# Altium schematic sheet Channel_supply.SchDoc
size A2
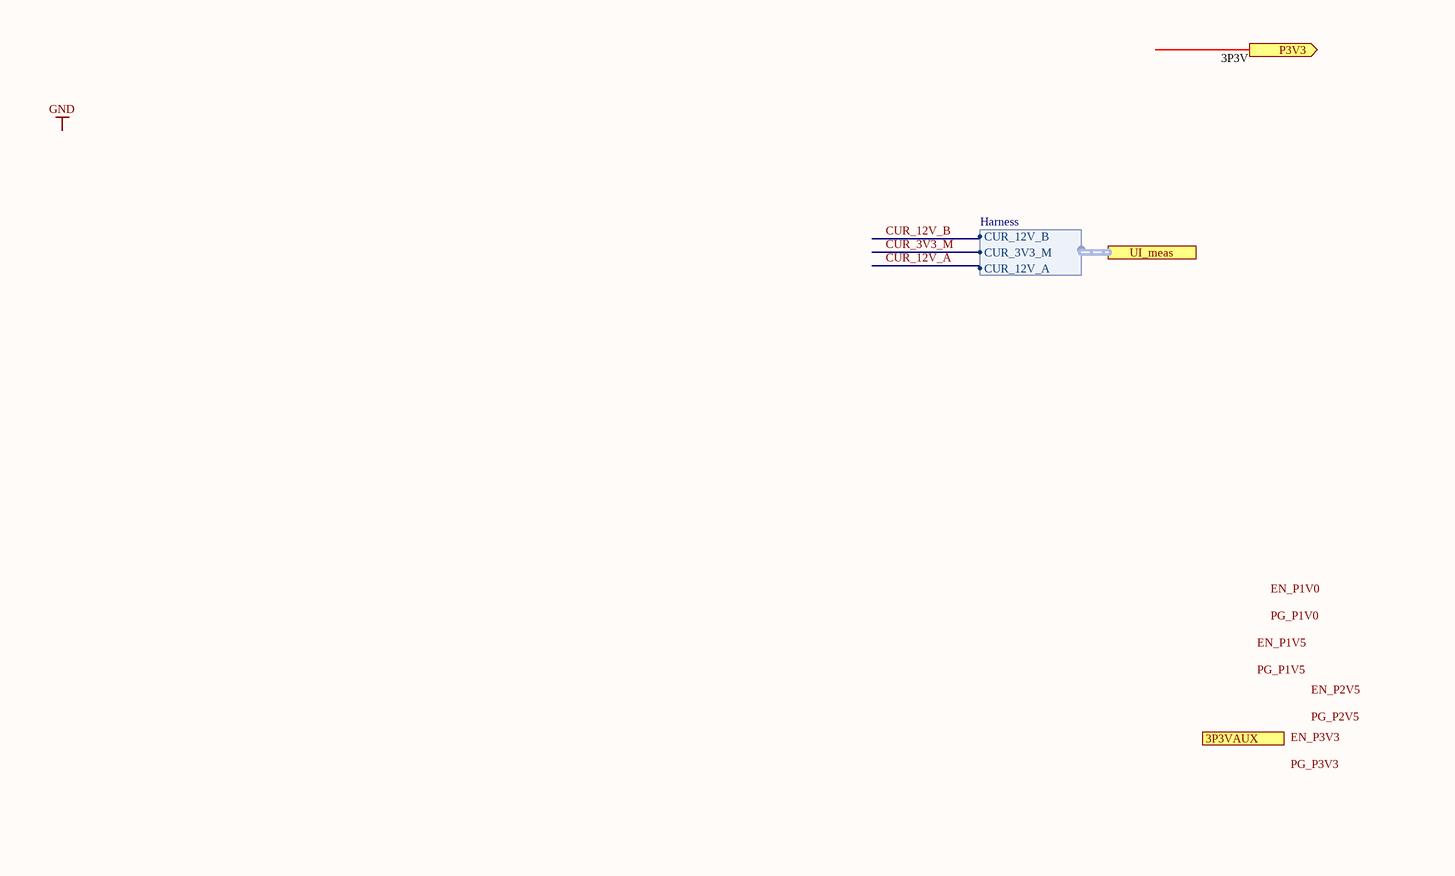
[diagram p0: Channel_supply.SchDoc, left]
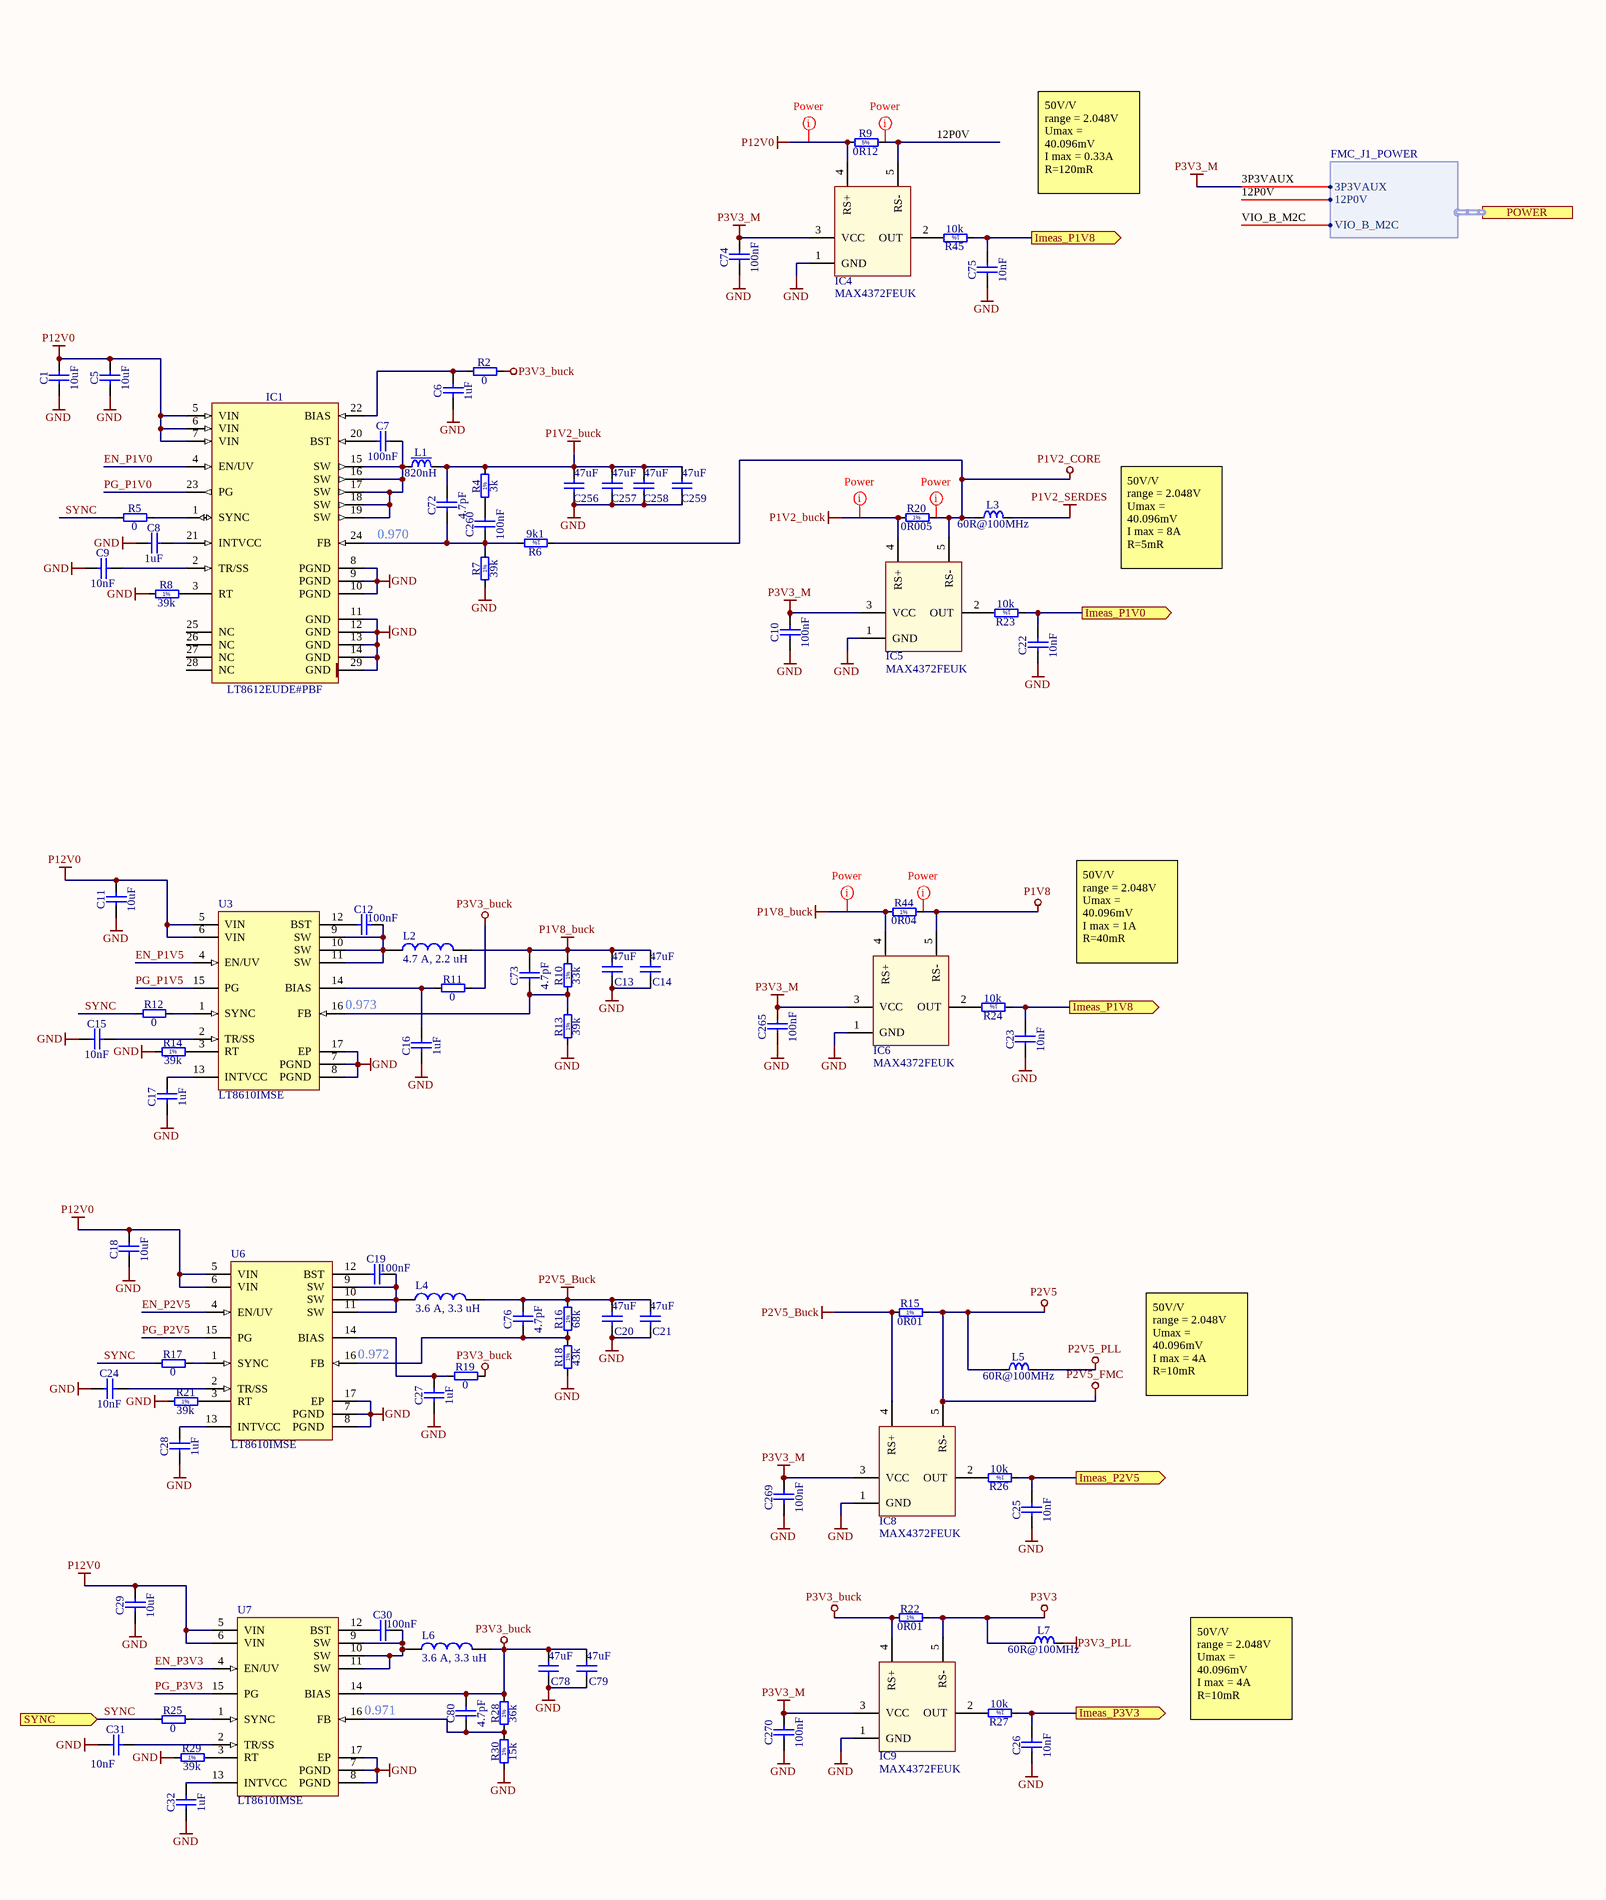
[diagram p1: Channel_supply.SchDoc, right]

## Parts
C1  10uF  [CAPC2012X95N]
C5  10uF  [CAPC2012X95N]
C6  1uF  [CAPC1608X87N]
C7  100nF  [CAPC1005X55N]
C8  1uF  [CAPC1608X87N]
C9  10nF  [CAPC1005X55N]
C10  100nF  [CAPC1005X55N]
C11  10uF  [CAPC2012X95N]
C12  100nF  [CAPC1005X55N]
C13  47uF  [CAPC2012X140N]
C14  47uF  [CAPC2012X140N]
C15  10nF  [CAPC1005X55N]
C16  1uF  [CAPC1608X87N]
C17  1uF  [CAPC1608X87N]
C18  10uF  [CAPC2012X95N]
C19  100nF  [CAPC1005X55N]
C20  47uF  [CAPC2012X140N]
C21  47uF  [CAPC2012X140N]
C22  10nF  [CAPC1005X55N]
C23  10nF  [CAPC1005X55N]
C24  10nF  [CAPC1005X55N]
C25  10nF  [CAPC1005X55N]
C26  10nF  [CAPC1005X55N]
C27  1uF  [CAPC1608X87N]
C28  1uF  [CAPC1608X87N]
C29  10uF  [CAPC2012X95N]
C30  100nF  [CAPC1005X55N]
C31  10nF  [CAPC1005X55N]
C32  1uF  [CAPC1608X87N]
C72  4.7pF  [CAPC1005X55N]
C73  4.7pF  [CAPC1005X55N]
C74  100nF  [CAPC1005X55N]
C75  10nF  [CAPC1005X55N]
C76  4.7pF  [CAPC1005X55N]
C78  47uF  [CAPC2012X140N]
C79  47uF  [CAPC2012X140N]
C80  4.7pF  [CAPC1005X55N]
C256  47uF  [CAPC2012X140N]
C257  47uF  [CAPC2012X140N]
C258  47uF  [CAPC2012X140N]
C259  47uF  [CAPC2012X140N]
C260  100nF  [CAPC1005X55N]
C265  100nF  [CAPC1005X55N]
C269  100nF  [CAPC1005X55N]
C270  100nF  [CAPC1005X55N]
IC1  LT8612EUDE#PBF  [QFN50P300X600X80-29N-R180X485]
IC4  MAX4372FEUK  [SOT95P270X145-5N]
IC5  MAX4372FEUK  [SOT95P270X145-5N]
IC6  MAX4372FEUK  [SOT95P270X145-5N]
IC8  MAX4372FEUK  [SOT95P270X145-5N]
IC9  MAX4372FEUK  [SOT95P270X145-5N]
L1  820nH  [INDP4040X21N]
L2  4.7 A, 2.2 uH  [WE-MAIA_4020]
L3  60R@100MHz  [INDC4516X180N]
L4  3.6 A, 3.3 uH  [WE-MAIA_4020]
L5  60R@100MHz  [INDC4516X180N]
L6  3.6 A, 3.3 uH  [WE-MAIA_4020]
L7  60R@100MHz  [INDC4516X180N]
R2  0  [RESC1005X40N]
R4  3k  [RESC1005X40N]
R5  0  [RESC1005X40N]
R6  9k1  [RESC1005X40N]
R7  39k  [RESC1005X40N]
R8  39k  [RESC1005X40N]
R9  0R12  [RESC2012X70N]
R10  33k  [RESC1005X40N]
R11  0  [RESC1005X40N]
R12  0  [RESC1005X40N]
R13  39k  [RESC1005X40N]
R14  39k  [RESC1005X40N]
R15  0R01  [RESC3216X80N]
R16  68k  [RESC1005X40N]
R17  0  [RESC1005X40N]
R18  43k  [RESC1005X40N]
R19  0  [RESC1005X40N]
R20  0R005  [RESC3216X80N]
R21  39k  [RESC1005X40N]
R22  0R01  [RESC3216X80N]
R23  10k  [RESC1005X40N]
R24  10k  [RESC1005X40N]
R25  0  [RESC1005X40N]
R26  10k  [RESC1005X40N]
R27  10k  [RESC1005X40N]
R28  36k  [RESC1005X40N]
R29  39k  [RESC1005X40N]
R30  15k  [RESC1005X40N]
R44  0R04  [RESC3216X89N]
R45  10k  [RESC1005X40N]
U3  LT8610IMSE  [LT-MSE-16-EDP_L]
U6  LT8610IMSE  [LT-MSE-16-EDP_L]
U7  LT8610IMSE  [LT-MSE-16-EDP_L]

## Ports
3P3VAUX (out), Imeas_P1V0 (out), Imeas_P1V8 (out), Imeas_P2V5 (out), Imeas_P3V3 (out), P3V3 (out), POWER (harness FMC_J1_POWER), SYNC (in), UI_meas (harness Harness)

## Harnesses
FMC_J1_POWER: 3P3VAUX, 12P0V, VIO_B_M2C
Harness: CUR_12V_B, CUR_3V3_M, CUR_12V_A

## Nets
3P3VAUX: C10.2 C74.2 C265.2 C269.2 C270.2 IC4.3(VCC) IC5.3(VCC) IC6.3(VCC) IC8.3(VCC) IC9.3(VCC) ; port POWER.3P3VAUX  [also labelled P3V3_M]
GND: C1.1 C5.1 C6.1 C8.1 C9.1 C10.1 C11.1 C13.1 C14.1 C15.1 C16.1 C17.1 C18.1 C20.1 C21.1 C22.1 C23.1 C24.1 C25.1 C26.1 C27.1 C28.1 C29.1 C31.1 C32.1 C74.1 C75.1 C78.1 C79.1 C256.1 C257.1 C258.1 C259.1 C265.1 C269.1 C270.1 IC1.8(PGND) IC1.9(PGND) IC1.10(PGND) IC1.11(GND) IC1.12(GND) IC1.13(GND) IC1.14(GND) IC1.29(GND) IC4.1(GND) IC5.1(GND) IC6.1(GND) IC8.1(GND) IC9.1(GND) R7.1 R8.1 R13.1 R14.1 R18.1 R21.1 R29.1 R30.1 U3.7(PGND) U3.8(PGND) U3.17(EP) U6.7(PGND) U6.8(PGND) U6.17(EP) U7.7(PGND) U7.8(PGND) U7.17(EP)
P1V2_buck: C72.2 C256.2 C257.2 C258.2 C259.2 IC5.4(RS+) L1.2 R4.2 R20.1
P1V2_CORE: IC5.5(RS-) L3.1 R6.1 R20.2
P1V2_SERDES: L3.2
P1V8: IC6.5(RS-) R44.2
P1V8_buck: C13.2 C14.2 C73.2 IC6.4(RS+) L2.2 R10.2 R44.1
P2V5: IC8.5(RS-) L5.1 R15.2  [also labelled P2V5_FMC]
P2V5_Buck: C20.2 C21.2 C76.2 IC8.4(RS+) L4.2 R15.1 R16.2
P2V5_PLL: L5.2
P3V3: IC9.5(RS-) L7.1 R22.2
P3V3_buck: C78.2 C79.2 C80.2 IC9.4(RS+) L6.2 R2.2 R11.2 R19.2 R22.1 R28.2 U7.14(BIAS)
P3V3_PLL: L7.2
P12V0: C1.2 C5.2 C11.2 C18.2 C29.2 IC1.5(VIN) IC1.6(VIN) IC1.7(VIN) IC4.4(RS+) R9.1 U3.5(VIN) U3.6(VIN) U6.5(VIN) U6.6(VIN) U7.5(VIN) U7.6(VIN)
3P3V: port P3V3
12P0V: IC4.5(RS-) R9.2 ; port POWER.12P0V
CUR_3V3_M: harness Harness.CUR_3V3_M
EN_P1V0: IC1.4(EN/UV)
EN_P1V5: U3.4(EN/UV)
EN_P2V5: U6.4(EN/UV)
EN_P3V3: U7.4(EN/UV)
Imeas_P1V0: C22.2 R23.1 ; port Imeas_P1V0
Imeas_P1V8: C23.2 C75.2 R24.1 R45.1 ; port Imeas_P1V8
Imeas_P2V5: C25.2 R26.1 ; port Imeas_P2V5
Imeas_P3V3: C26.2 R27.1 ; port Imeas_P3V3
PG_P1V0: IC1.23(PG)
PG_P1V5: U3.15(PG)
PG_P2V5: U6.15(PG)
PG_P3V3: U7.15(PG)
SYNC: R5.1 R12.1 R17.1 R25.1 ; port SYNC
VIO_B_M2C: port POWER.VIO_B_M2C
NetC6_2: C6.2 IC1.22(BIAS) R2.1
NetC7_1: C7.1 IC1.20(BST)
NetC7_2: C7.2 IC1.15(SW) IC1.16(SW) IC1.17(SW) IC1.18(SW) IC1.19(SW) L1.1
NetC8_2: C8.2 IC1.21(INTVCC)
NetC9_2: C9.2 IC1.2(TR/SS)
NetC12_1: C12.1 U3.12(BST)
NetC12_2: C12.2 L2.1 U3.9(SW) U3.10(SW) U3.11(SW)
NetC15_2: C15.2 U3.2(TR/SS)
NetC16_2: C16.2 R11.1 U3.14(BIAS)
NetC17_2: C17.2 U3.13(INTVCC)
NetC19_1: C19.1 U6.12(BST)
NetC19_2: C19.2 L4.1 U6.9(SW) U6.10(SW) U6.11(SW)
NetC24_2: C24.2 U6.2(TR/SS)
NetC27_2: C27.2 R19.1 U6.14(BIAS)
NetC28_2: C28.2 U6.13(INTVCC)
NetC30_1: C30.1 U7.12(BST)
NetC30_2: C30.2 L6.1 U7.9(SW) U7.10(SW) U7.11(SW)
NetC31_2: C31.2 U7.2(TR/SS)
NetC32_2: C32.2 U7.13(INTVCC)
NetC72_1: C72.1 C260.1 IC1.24(FB) R6.2 R7.2
NetC73_1: C73.1 R10.1 R13.2 U3.16(FB)
NetC76_1: C76.1 R16.1 R18.2 U6.16(FB)
NetC80_1: C80.1 R28.1 R30.2 U7.16(FB)
NetC260_2: C260.2 R4.1
NetIC1_1: IC1.1(SYNC) R5.2
NetIC1_3: IC1.3(RT) R8.2
NetIC4_2: IC4.2(OUT) R45.2
NetIC5_2: IC5.2(OUT) R23.2
NetIC6_2: IC6.2(OUT) R24.2
NetIC8_2: IC8.2(OUT) R26.2
NetIC9_2: IC9.2(OUT) R27.2
NetR12_2: R12.2 U3.1(SYNC)
NetR14_2: R14.2 U3.3(RT)
NetR17_2: R17.2 U6.1(SYNC)
NetR21_2: R21.2 U6.3(RT)
NetR25_2: R25.2 U7.1(SYNC)
NetR29_2: R29.2 U7.3(RT)

Not connected (* = marked no-connect by the designer): IC1 25(NC) 26(NC) 27(NC) 28(NC)

## Layout directives
net class Power: 12P0V, P1V2_buck, P1V2_CORE, P1V8, P1V8_buck, P12V0

## Notes on the sheet
- 50V/V
  range = 2.048V
  Umax = 40.096mV
  I max = 0.33A
  R=120mR
- 0.970
- 50V/V
  range = 2.048V
  Umax = 40.096mV
  I max = 8A
  R=5mR
- 50V/V
  range = 2.048V
  Umax = 40.096mV
  I max = 1A
  R=40mR
- (near U3) 0.973
- (near U6) 0.972
- 50V/V
  range = 2.048V
  Umax = 40.096mV
  I max = 4A
  R=10mR
- (near U7) 0.971
- Labels drawn without touching a wire or pin: EN_P1V0, EN_P1V5, EN_P2V5, EN_P3V3, GND, PG_P1V0, PG_P1V5, PG_P2V5, PG_P3V3
- (in symbol R0402_3K_1%_0.0625W_100PPM) 1%
- (in symbol R0402_9K1_1%_0.0625W_100PPM) 1%
- (in symbol R0402_10K_1%_0.0625W_100PPM) 1%
- (in symbol R0402_15K_1%_0.0625W_100PPM) 1%
- (in symbol R0402_33K_1%_0.0625W_100PPM) 1%
- (in symbol R0402_36K_1%_0.0625W_100PPM) 1%
- (in symbol R0402_39K_1%_0.0625W_100PPM) 1%
- (in symbol R0402_43K_1%_0.0625W_100PPM) 1%
- (in symbol R0402_68K_1%_0.0625W_100PPM) 1%
- (in symbol R0805_0R12_5%_0.25W_250PPM_PANASONIC_ERJ) 5%
- (in symbol R1206_0R01_1%_1W_100PPM_TT_LRMAM1206) 1%
- (in symbol R1206_0R04_1%_0.5W_100PPM_VISHAY_WSL) 1%
- (in symbol R1206_0R005_1%_1W_100PPM_TT_LRMAM1206) 1%

## Library data of the parts
C1 C5 C11 C18 C29 = CC0805_10UF_25V_10%_X5R: Non-polarised capacitor; Part Description: SMD Multilayer Chip Ceramic Capacitor; Manufacturer: GENERIC; Manufacturer1 Part Number: GRM219R61E106KA12D; Voltage: 25V; TC: X5R; Tolerance: ±10%; Part Number: CC0805_10UF_25V_10%_X5R; Component Kind: Standard; Component Type: Standard; Pin Count: 2; Value: 10uF; Status: Preferred; Manufacturer Part Number: CC0805_10UF_25V_10%_X5R; Case: 0805; Mounted: Yes; Socket: No; SMD: Yes; Sense: No; Manufacturer1 Example: MURATA; Manufacturer1 ComponentHeight: 0.95mm; HelpURL: \\cern.ch\dfs\Applications\Altium\Datasheets\CC0805_X5R_MURATA_GRM.pdf; Author: CERN DEM JLC; CreateDate: 25/10/2012; LatestRevisionDate: 06/09/2016
C6 C8 C16 C17 C27 C28 C32 = CC0603_1UF_25V_10%_X7R: Non-polarised capacitor; Part Description: SMD Multilayer Chip Ceramic Capacitor; Manufacturer: GENERIC; Manufacturer1 Part Number: GRM188R71E105KA12D; Voltage: 25V; TC: X7R; Tolerance: ±10%; Part Number: CC0603_1UF_25V_10%_X7R; Component Kind: Standard; Component Type: Standard; Pin Count: 2; Value: 1uF; Status: None; Manufacturer Part Number: CC0603_1UF_25V_10%_X7R; Case: 0603; Mounted: Yes; Socket: No; SMD: Yes; Sense: No; Manufacturer1 Example: MURATA; Manufacturer1 ComponentHeight: 0.9mm; HelpURL: \\cern.ch\dfs\Applications\Altium\Datasheets\CC0603_X7R_MURATA.pdf; Author: CERN DEM JLC; CreateDate: 18/01/2011; LatestRevisionDate: 18/01/2011
C7 C10 C12 C19 C30 C74 C260 C265 C269 C270 = CC0402_100NF_25V_10%_X7R_YUDEN_TMK105B7104KVHF: Non-polarised capacitor; Part Description: SMD Multilayer Chip Ceramic Capacitor (High Dielectric Type) for Automotive / Industrial Applications; Manufacturer: TAIYO YUDEN; Voltage: 25V; TC: X7R; Tolerance: ±10%; Part Number: CC0402_100NF_25V_10%_X7R_YUDEN_TMK105B7104KVHF; Component Kind: Standard; Component Type: Standard; Pin Count: 2; Value: 100nF; Status: Not Recommended; Manufacturer Part Number: TMK105B7104KVHF; Case: 0402; Mounted: Yes; Socket: No; SMD: Yes; Sense: No; ComponentHeight: 0.55mm; HelpURL: \\cern.ch\dfs\Applications\Altium\Datasheets\CC0402_TAIYO-YUDEN_TMK105B7104KVHF.pdf; Author: CERN DEM JLC; CreateDate: 10/05/2017; LatestRevisionDate: 10/05/2017
C9 C15 C24 C31 = CC0402_10NF_25V_10%_X7R: Non-polarised capacitor; Part Description: SMD Multilayer Chip Ceramic Capacitor; Manufacturer: GENERIC; Manufacturer1 Part Number: C1005X7R1E103KT; Voltage: 25V; TC: X7R; Tolerance: ±10%; Part Number: CC0402_10NF_25V_10%_X7R; Component Kind: Standard; Component Type: Standard; Pin Count: 2; Value: 10nF; Status: Preferred; Manufacturer Part Number: CC0402_10NF_25V_10%_X7R; Case: 0402; Mounted: Yes; Socket: No; SMD: Yes; Sense: No; Manufacturer1 Example: TDK; Manufacturer1 ComponentHeight: 0.55mm; HelpURL: \\cern.ch\dfs\Applications\Altium\Datasheets\CC0402_X7R_TDK_C.pdf; Author: CERN DEM JLC; CreateDate: 25/10/2012; LatestRevisionDate: 25/10/2012
C13 C14 C20 C21 C78 C79 C256-C259 = CC0805_47UF_6.3V_20%_X5R: Non-polarised capacitor; Manufacturer: GENERIC; Part Description: SMD Multilayer Chip Ceramic Capacitor; Manufacturer1 Part Number: C0805C476M9PACTU; Voltage: 6.3V; TC: X5R; Tolerance: ±20%; Part Number: CC0805_47UF_6.3V_20%_X5R; Component Kind: Standard; Component Type: Standard; Pin Count: 2; Value: 47uF; Status: Preferred; Manufacturer Part Number: CC0805_47UF_6.3V_20%_X5R; Case: 0805; Mounted: Yes; Socket: No; SMD: Yes; Sense: No; Manufacturer1 Example: KEMET; Manufacturer1 ComponentHeight: 1.4mm; HelpURL: \\cern.ch\dfs\Applications\Altium\Datasheets\CC0805_X5R_KEMET.pdf; Author: CERN DEM JLC; CreateDate: 16/10/2012; LatestRevisionDate: 16/10/2012
C22 C23 C25 C26 C75 = CC0402_10NF_50V_10%_X7R: Non-polarised capacitor; Part Description: SMD Multilayer Chip Ceramic Capacitor; Manufacturer: GENERIC; Manufacturer1 Part Number: GRM155R71H103KA88D; Voltage: 50V; TC: X7R; Tolerance: ±10%; Part Number: CC0402_10NF_50V_10%_X7R; Component Kind: Standard; Component Type: Standard; Pin Count: 2; Value: 10nF; Status: None; Manufacturer Part Number: CC0402_10NF_50V_10%_X7R; Case: 0402; Mounted: Yes; Socket: No; SMD: Yes; Sense: No; Manufacturer1 Example: MURATA; Manufacturer1 ComponentHeight: 0.55mm; HelpURL: \\cern.ch\dfs\Applications\Altium\Datasheets\CC0402_X7R_MURATA_GRM.pdf; Author: CERN DEM MR; CreateDate: 08/01/2016; LatestRevisionDate: 08/01/2016
C72 C73 C76 C80 = CC0402_4.7PF_50V_0.25PF_C0G: Non-polarised capacitor; Part Description: SMD Multilayer Chip Ceramic Capacitor; Manufacturer: GENERIC; Manufacturer1 Part Number: C0402C479C5GACTU; Voltage: 50V; TC: C0G/NP0; Tolerance: ±0.25pF; Part Number: CC0402_4.7PF_50V_0.25PF_C0G; Component Kind: Standard; Component Type: Standard; Pin Count: 2; Value: 4.7pF; Status: Preferred; Manufacturer Part Number: CC0402_4.7PF_50V_0.25PF_C0G; Case: 0402; Mounted: Yes; Socket: No; SMD: Yes; Sense: No; Manufacturer1 Example: KEMET; Manufacturer1 ComponentHeight: 0.55mm; HelpURL: \\cern.ch\dfs\Applications\Altium\Datasheets\CC0805_C0G_KEMET_(Commercial Grade).pdf; Author: CERN DEM JLC; CreateDate: 03/12/2007; LatestRevisionDate: 22/04/2015
IC1 = LT8612EUDE#PBF: 42V, 6A Synchronous Step-Down Regulator with 3µA Quiescent Current; Part Description: 42V, 6A Synchronous Step-Down Regulator with 3uA Quiescent Current; Manufacturer: LINEAR TECHNOLOGY; PressFit: No; Bonding: No; Part Number: LT8612EUDE#PBF; Component Kind: Standard; Component Type: Standard; Device: LT8612EUDE#PBF; PackageDescription: QFN, 0.50mm Pitch, Rect.; 28 pin, 6.00mm L X 3.00mm W X 0.80mm H bodY (w/thermal tab 1.80 X 4.85mm), IPC Medium Density; Manufacturer Part Number: LT8612EUDE#PBF; Pin Count: 29; Case: QFN28; Mounted: Yes; Socket: No; SMD: Yes; Sense: No; ComponentHeight: 0.8mm; HelpURL: \\cern.ch\dfs\Applications\Altium\Datasheets\LT8612EUDE#PBF.pdf; Author: CERN DEM JLC; CreateDate: 16/05/2018; LatestRevisionDate: 16/05/2018
IC4-IC6 IC8 IC9 = PM_MAX4372FEUK: Manufacturer: Maxim; Part Description: High side current sense amplifier (x50); Bonding: No; PressFit: No; Case: SOT23-5; Component Kind: Standard; Component Type: Standard; ComponentHeigth: *; CreateDate: 2018-01-01; Device: MAX4372FEUK; Footprint: SOT23-5; HelpURL: *; LatestRevisionDate: 2018-01-01; Manufacturer Part Number: MAX4372FEUK; Mounted: Yes; PackageDescription: SOT23-5; Part Number: MAX4372FEUK; Pin Count: 5; Sense: No; SMD: Yes; Socket: No; Value: MAX4372FEUK
L1 = L_POWER_XEL4020_820uH_10A: Inductor With Core; Part Number: IND_820NH_COILCRAFT_XEL4020-821MEC; Part Description: SMT Power Inductor XEL4020 Series; Manufacturer: COILCRAFT; Manufacturer Part Number: XEL4020-821MEC; Power: 10A; Resistance: 0.011R; Tolerance: ±20%; Component Kind: Standard; Component Type: Standard; Pin Count: 2; Value: 820nH; Status: None; Case: 4040; Mounted: Yes; Socket: No; SMD: Yes; Sense: No; ComponentHeight: 2.03mm; HelpURL: \\cern.ch\dfs\Applications\Altium\Datasheets\IND_COILCRAFT_1008CS.pdf; Author: GK; CreateDate: 09/11/2017; LatestRevisionDate: 09/11/2017
L2 = 78438356022: WE-MAIA SMD Power Inductor, size 4020, 4.7 A, 2.2 uH; Rated Current: 4.7 A; Inductance: 2.2 uH; DC Resistance max.: 35 mOhm; ComponentLink1Description: Manufacturer; ComponentLink1URL: http://www.we-online.de; ComponentLink2Description: Datasheet; ComponentLink2URL: http://katalog.we-online.de/pbs/datasheet/78438356022.pdf; Part Number: 78438356022; Published Date: Nov. 2017; Publisher: Wurth Elektronik; Size: 4020; Operating Temperature: -40 to 125 degC
L3 L5 L7 = IND1806_MURATA_BLM41PG600SN1L: Inductor; Part Description: SMD EMI Suppression Chip Ferrite Bead (BLM41P Series); Manufacturer: MURATA; Power: 6A; Resistance: 0.01R; Part Number: IND1806_MURATA_BLM41PG600SN1L; Component Kind: Standard; Component Type: Standard; Pin Count: 2; Value: 60R@100MHz; Status: None; Manufacturer Part Number: BLM41PG600SN1L; Case: 1806; Mounted: Yes; Socket: No; SMD: Yes; Sense: No; ComponentHeight: 1.8mm; HelpURL: \\cern.ch\dfs\Applications\Altium\Datasheets\IND1806_MURATA_BLM41P.pdf; Author: CERN DEM JLC; CreateDate: 02/12/2009; LatestRevisionDate: 02/12/2009
L4 L6 = 78438356033: WE-MAIA SMD Power Inductor, size 4020, 3.6 A, 3.3 uH; Rated Current: 3.6 A; Inductance: 3.3 uH; DC Resistance max.: 48 mOhm; ComponentLink1Description: Manufacturer; ComponentLink1URL: http://www.we-online.de; ComponentLink2Description: Datasheet; ComponentLink2URL: http://katalog.we-online.de/pbs/datasheet/78438356033.pdf; Part Number: 78438356033; Published Date: Nov. 2017; Publisher: Wurth Elektronik; Size: 4020; Operating Temperature: -40 to 125 degC
R2 R5 R11 R12 R17 R19 R25 = R0402_0R_JUMPER: Resistor; Part Description: 1A (0.05R Max DC Resistance) Zero Ohm Jumper; Manufacturer: GENERIC; Manufacturer1 Part Number: 232270591001L; PressFit: No; Part Number: R0402_0R_JUMPER; Component Kind: Standard; Component Type: Standard; Pin Count: 2; Value: 0; Status: Not Recommended; Manufacturer Part Number: R0402_0R_JUMPER; Case: 0402; Mounted: Yes; Sense: No; Socket: No; SMD: Yes; Manufacturer1 Example: YAGEO PHYCOMP; Manufacturer1 ComponentHeight: 0.4mm; HelpURL: \\cern.ch\dfs\Applications\Altium\Datasheets\R0402_Phycomp_RC0402.pdf; Author: CERN DEM JLC; CreateDate: 03/12/2007; LatestRevisionDate: 17/10/2012
R4 = R0402_3K_1%_0.0625W_100PPM: Resistor - 1%; Part Description: General Purpose Thick Film Chip Resistor; Manufacturer: GENERIC; Manufacturer1 Part Number: 232270673002L; TC: ±100ppm/°C; PressFit: No; Part Number: R0402_3K_1%_0.0625W_100PPM; Component Kind: Standard; Component Type: Standard; Pin Count: 2; Value: 3k; Status: Not Recommended; Power: 0.0625W; Tolerance: ±1%; Manufacturer Part Number: R0402_3K_1%_0.0625W_100PPM; Case: 0402; Mounted: Yes; Sense: No; Socket: No; SMD: Yes; Manufacturer1 Example: YAGEO PHYCOMP; Manufacturer1 ComponentHeight: 0.4mm; HelpURL: \\cern.ch\dfs\Applications\Altium\Datasheets\R0402_Phycomp_RC0402.pdf; Author: CERN DEM JLC; CreateDate: 03/12/2007; LatestRevisionDate: 17/10/2012
R6 = R0402_9K1_1%_0.0625W_100PPM: Resistor - 1%; Part Description: General Purpose Thick Film Chip Resistor; Manufacturer: GENERIC; Manufacturer1 Part Number: 232270679102L; TC: ±100ppm/°C; PressFit: No; Part Number: R0402_9K1_1%_0.0625W_100PPM; Component Kind: Standard; Component Type: Standard; Pin Count: 2; Value: 9k1; Status: Not Recommended; Power: 0.0625W; Tolerance: ±1%; Manufacturer Part Number: R0402_9K1_1%_0.0625W_100PPM; Case: 0402; Mounted: Yes; Sense: No; Socket: No; SMD: Yes; Manufacturer1 Example: YAGEO PHYCOMP; Manufacturer1 ComponentHeight: 0.4mm; HelpURL: \\cern.ch\dfs\Applications\Altium\Datasheets\R0402_Phycomp_RC0402.pdf; Author: CERN DEM JLC; CreateDate: 03/12/2007; LatestRevisionDate: 17/10/2012
R7 R8 R13 R14 R21 R29 = R0402_39K_1%_0.0625W_100PPM: Resistor - 1%; Part Description: General Purpose Thick Film Chip Resistor; Manufacturer: GENERIC; Manufacturer1 Part Number: 232270673903; TC: ±100ppm/°C; PressFit: No; Part Number: R0402_39K_1%_0.0625W_100PPM; Component Kind: Standard; Component Type: Standard; Pin Count: 2; Value: 39k; Status: Not Recommended; Power: 0.0625W; Tolerance: ±1%; Manufacturer Part Number: R0402_39K_1%_0.0625W_100PPM; Case: 0402; Mounted: Yes; Sense: No; Socket: No; SMD: Yes; Manufacturer1 Example: YAGEO PHYCOMP; Manufacturer1 ComponentHeight: 0.4mm; HelpURL: \\cern.ch\dfs\Applications\Altium\Datasheets\R0402_Phycomp_RC0402.pdf; Author: CERN DEM JLC; CreateDate: 03/12/2007; LatestRevisionDate: 17/10/2012
R9 = R0805_0R12_5%_0.25W_250PPM_PANASONIC_ERJ: Resistor - 5%; Part Description: Low Resistance Thick Film Chip Resistor; Manufacturer Part Number: ERJ6BSJR12V; Power: 0.25W; TC: ±250ppm/°C; PressFit: No; Part Number: R0805_0R12_5%_0.25W_250PPM_PANASONIC_ERJ; Component Kind: Standard; Component Type: Standard; Pin Count: 2; Value: 0R12; Status: Not Recommended; Tolerance: ±5%; Manufacturer: PANASONIC; Case: 0805; Mounted: Yes; Sense: No; Socket: No; SMD: Yes; ComponentHeight: 0.7mm; HelpURL: \\cern.ch\dfs\Applications\Altium\Datasheets\R0805_PANASONIC_ERJ.pdf; Author: CERN DEM JLC; CreateDate: 19/12/2011; LatestRevisionDate: 19/12/2011
R10 = R0402_33K_1%_0.0625W_100PPM: Resistor - 1%; Part Description: General Purpose Thick Film Chip Resistor; Manufacturer: GENERIC; Manufacturer1 Part Number: 232270673303L; TC: ±100ppm/°C; PressFit: No; Part Number: R0402_33K_1%_0.0625W_100PPM; Component Kind: Standard; Component Type: Standard; Pin Count: 2; Value: 33k; Status: Not Recommended; Power: 0.0625W; Tolerance: ±1%; Manufacturer Part Number: R0402_33K_1%_0.0625W_100PPM; Case: 0402; Mounted: Yes; Sense: No; Socket: No; SMD: Yes; Manufacturer1 Example: YAGEO PHYCOMP; Manufacturer1 ComponentHeight: 0.4mm; HelpURL: \\cern.ch\dfs\Applications\Altium\Datasheets\R0402_Phycomp_RC0402.pdf; Author: CERN DEM JLC; CreateDate: 03/12/2007; LatestRevisionDate: 17/10/2012
R15 R22 = R1206_0R01_1%_1W_100PPM_TT_LRMAM1206: Resistor - 1%; Part Description: Low Value Metal Alloy Resistor; Manufacturer: TT Electronics; Manufacturer Part Number: LRMAM1206-R01FT5; Power: 1W; TC: ±100ppm/°C; PressFit: No; Part Number: R1206_0R01_1%_1W_100PPM_TT_LRMAM1206; Component Kind: Standard; Component Type: Standard; Pin Count: 2; Value: 0R01; Status: Not Recommended; Tolerance: ±1%; Case: 1206; Mounted: Yes; Sense: No; Socket: No; SMD: Yes; ComponentHeight: 0.8mm; HelpURL: \\cern.ch\dfs\Applications\Altium\Datasheets\R1206_TT ELECTRONICS_LRMA.pdf; Author: CERN DEM BC; CreateDate: 29/07/2015; LatestRevisionDate: 29/07/2015
R16 = R0402_68K_1%_0.0625W_100PPM: Resistor - 1%; Part Description: General Purpose Thick Film Chip Resistor; Manufacturer: GENERIC; Manufacturer1 Part Number: 232270676803L; TC: ±100ppm/°C; PressFit: No; Part Number: R0402_68K_1%_0.0625W_100PPM; Component Kind: Standard; Component Type: Standard; Pin Count: 2; Value: 68k; Status: Not Recommended; Power: 0.0625W; Tolerance: ±1%; Manufacturer Part Number: R0402_68K_1%_0.0625W_100PPM; Case: 0402; Mounted: Yes; Sense: No; Socket: No; SMD: Yes; Manufacturer1 Example: YAGEO PHYCOMP; Manufacturer1 ComponentHeight: 0.4mm; HelpURL: \\cern.ch\dfs\Applications\Altium\Datasheets\R0402_Phycomp_RC0402.pdf; Author: CERN DEM JLC; CreateDate: 03/12/2007; LatestRevisionDate: 17/10/2012
R18 = R0402_43K_1%_0.0625W_100PPM: Resistor - 1%; Part Description: General Purpose Thick Film Chip Resistor; Manufacturer: GENERIC; Manufacturer1 Part Number: 232270674303L; TC: ±100ppm/°C; PressFit: No; Part Number: R0402_43K_1%_0.0625W_100PPM; Component Kind: Standard; Component Type: Standard; Pin Count: 2; Value: 43k; Status: Not Recommended; Power: 0.0625W; Tolerance: ±1%; Manufacturer Part Number: R0402_43K_1%_0.0625W_100PPM; Case: 0402; Mounted: Yes; Sense: No; Socket: No; SMD: Yes; Manufacturer1 Example: YAGEO PHYCOMP; Manufacturer1 ComponentHeight: 0.4mm; HelpURL: \\cern.ch\dfs\Applications\Altium\Datasheets\R0402_Phycomp_RC0402.pdf; Author: CERN DEM JLC; CreateDate: 03/12/2007; LatestRevisionDate: 17/10/2012
R20 = R1206_0R005_1%_1W_100PPM_TT_LRMAM1206: Resistor - 1%; Part Description: Low Value Metal Alloy Resistor; Manufacturer: TT Electronics; Manufacturer Part Number: LRMAM1206-R005FT5; Power: 1W; TC: ±100ppm/°C; PressFit: No; Part Number: R1206_0R005_1%_1W_100PPM_TT_LRMAM1206; Component Kind: Standard; Component Type: Standard; Pin Count: 2; Value: 0R005; Status: Not Recommended; Tolerance: ±1%; Case: 1206; Mounted: Yes; Sense: No; Socket: No; SMD: Yes; ComponentHeight: 0.8mm; HelpURL: \\cern.ch\dfs\Applications\Altium\Datasheets\R1206_TT ELECTRONICS_LRMA.pdf; Author: CERN DEM BC; CreateDate: 29/07/2015; LatestRevisionDate: 29/07/2015
R23 R24 R26 R27 R45 = R0402_10K_1%_0.0625W_100PPM: Resistor - 1%; Part Description: General Purpose Thick Film Chip Resistor; Manufacturer: GENERIC; Manufacturer1 Part Number: 232270671003L; TC: ±100ppm/°C; PressFit: No; Part Number: R0402_10K_1%_0.0625W_100PPM; Component Kind: Standard; Component Type: Standard; Pin Count: 2; Value: 10k; Status: Not Recommended; Power: 0.0625W; Tolerance: ±1%; Manufacturer Part Number: R0402_10K_1%_0.0625W_100PPM; Case: 0402; Mounted: Yes; Sense: No; Socket: No; SMD: Yes; Manufacturer1 Example: YAGEO PHYCOMP; Manufacturer1 ComponentHeight: 0.4mm; HelpURL: \\cern.ch\dfs\Applications\Altium\Datasheets\R0402_Phycomp_RC0402.pdf; Author: CERN DEM JLC; CreateDate: 03/12/2007; LatestRevisionDate: 17/10/2012
R28 = R0402_36K_1%_0.0625W_100PPM: Resistor - 1%; Part Description: General Purpose Thick Film Chip Resistor; Manufacturer: GENERIC; Manufacturer1 Part Number: 232270673603L; TC: ±100ppm/°C; PressFit: No; Part Number: R0402_36K_1%_0.0625W_100PPM; Component Kind: Standard; Component Type: Standard; Pin Count: 2; Value: 36k; Status: Not Recommended; Power: 0.0625W; Tolerance: ±1%; Manufacturer Part Number: R0402_36K_1%_0.0625W_100PPM; Case: 0402; Mounted: Yes; Sense: No; Socket: No; SMD: Yes; Manufacturer1 Example: YAGEO PHYCOMP; Manufacturer1 ComponentHeight: 0.4mm; HelpURL: \\cern.ch\dfs\Applications\Altium\Datasheets\R0402_Phycomp_RC0402.pdf; Author: CERN DEM JLC; CreateDate: 03/12/2007; LatestRevisionDate: 17/10/2012
R30 = R0402_15K_1%_0.0625W_100PPM: Resistor - 1%; Part Description: General Purpose Thick Film Chip Resistor; Manufacturer: GENERIC; Manufacturer1 Part Number: CRCW040215K0FKED; TC: ±100ppm/°C; PressFit: No; Part Number: R0402_15K_1%_0.0625W_100PPM; Component Kind: Standard; Component Type: Standard; Pin Count: 2; Value: 15k; Status: None; Power: 0.0625W; Tolerance: ±1%; Manufacturer Part Number: R0402_15K_1%_0.0625W_100PPM; Case: 0402; Mounted: Yes; Sense: No; Socket: No; SMD: Yes; Manufacturer1 Example: VISHAY; Manufacturer1 ComponentHeight: 0.4mm; HelpURL: \\cern.ch\dfs\Applications\Altium\Datasheets\R0402_VISHAY_CRCW e3.pdf; Author: CERN DEM JMW; CreateDate: 06/07/2015; LatestRevisionDate: 06/07/2015
R44 = R1206_0R04_1%_0.5W_100PPM_VISHAY_WSL: Resistor - 1%; Part Description: Power Metal Strip® Resistor; Manufacturer: VISHAY DALE; Manufacturer Part Number: WSL1206R0400FEA; Power: 0.5W; TC: ±100ppm/°C; PressFit: No; Part Number: R1206_0R04_1%_0.5W_100PPM_VISHAY_WSL; Component Kind: Standard; Component Type: Standard; Pin Count: 2; Value: 0R04; Status: None; Tolerance: ±1%; Case: 1206; Mounted: Yes; Sense: No; Socket: No; SMD: Yes; ComponentHeight: 0.89mm; HelpURL: \\cern.ch\dfs\Applications\Altium\Datasheets\R1206_VISHAY_WSL.pdf; Author: CERN DEM JMW; CreateDate: 06/07/2015; LatestRevisionDate: 06/07/2015
U3 U6 U7 = CMP-0491-01209-1: 2.5 A Synchronous Step-Down Regulator 2.5 uA Quiescent Current, 16-pin SOP (MSE-16-EDP), -40 to 125 degC; Manufacturer: Linear Technology; Number of Outputs: 1; Frequency Adjust Range: 200kHz - 2.2MHz; ComponentLink1URL: http://www.linear.com/; PackageVersion: Rev. F, 05/2013; PackageDescription: 16-Pin Plastic MSOP, Exposed Die Pad, Body 4.039 x 3 mm, Pitch 0.5 mm; ComponentLink3URL: http://cds.linear.com/docs/en/packaging/05081667_F_MSE16.pdf; ComponentLink2Description: Datasheet; PackageReference: MSE-16; Mounting Technology: Surface Mount; PartNumber: LT8610IMSE; RoHS: FALSE; ComponentLink3Description: Package Specification; ComponentLink1Description: Manufacturer URL; ComponentLink2URL: http://cds.linear.com/docs/en/datasheet/8610f.pdf